# Altium project guitar-pedal.PrjPcb
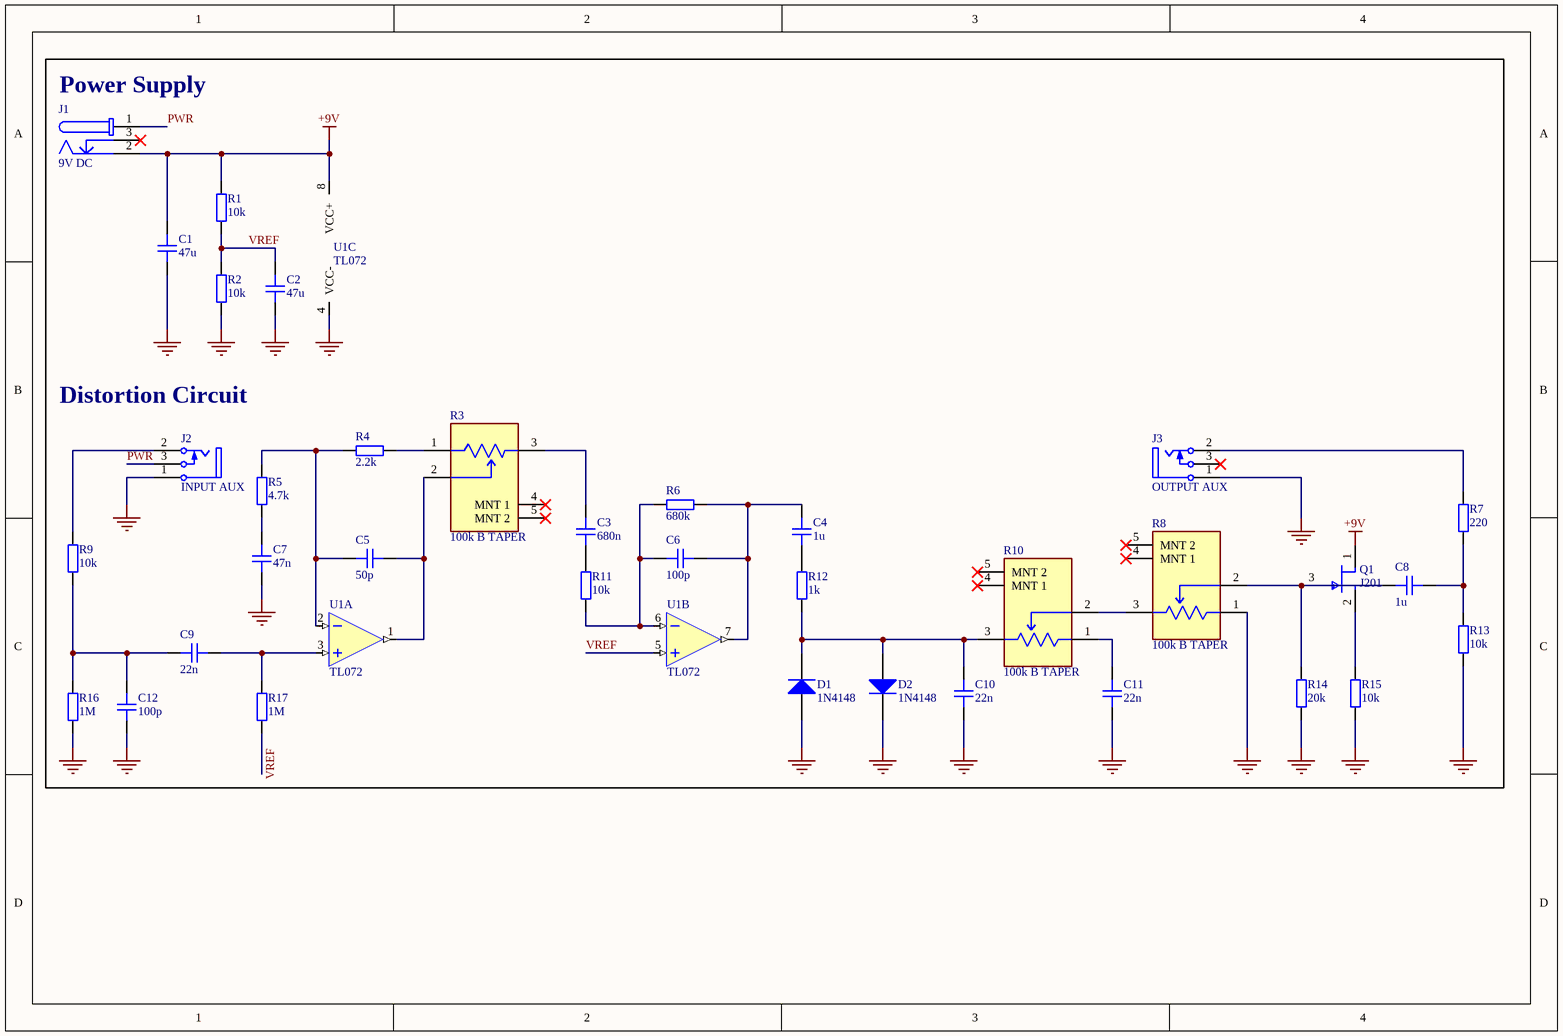
[diagram p0: schematic.SchDoc]
1 sheet, 36 parts. Net scope: global (net labels, ports and power ports of the same name join across sheets).
Board file: pcb.PcbDoc

## Sheet schematic.SchDoc
size A4; SheetNumber: 1; SheetTotal: 1

### Parts
C1  47u  [CAP_0603]
C2  47u  [CAP_0603]
C3  680n  [CAP_0603]
C4  1u  [CAP_0603]
C5  50p  [CAP_0603]
C6  100p  [CAP_0603]
C7  47n  [CAP_0603]
C8  1u  [CAP_0603]
C9  22n  [CAP_0603]
C10  22n  [CAP_0603]
C11  22n  [CAP_0603]
C12  100p  [CAP_0603]
D1  1N4148  [DIOD-SOD323-2-A_V]
D2  1N4148  [DIOD-SOD323-2-A_V]
J1  9V DC  [694106301002]
J2  INPUT AUX  [SWIT-PJRAN1X1U01X_V]
J3  OUTPUT AUX  [SWIT-PJRAN1X1U01X_V]
Q1  J201  [FP-318BM-IPC_C]
R1  10k  [RES_0603]
R2  10k  [RES_0603]
R3  100k B TAPER  [FP-PTV09A-4-MFG]
R4  2.2k  [RES_0603]
R5  4.7k  [RES_0603]
R6  680k  [RES_0603]
R7  220  [RES_0603]
R8  100k B TAPER  [FP-PTV09A-4-MFG]
R9  10k  [RES_0603]
R10  100k B TAPER  [FP-PTV09A-4-MFG]
R11  10k  [RES_0603]
R12  1k  [RES_0603]
R13  10k  [RES_0603]
R14  20k  [RES_0603]
R15  10k  [RES_0603]
R16  1M  [RES_0603]
R17  1M  [RES_0603]
U1  TL072  [SOIC-8]  (parts A,B,C of 3)

### Nets
+9V: C1.1 J1.2 Q1.1(D) R1.2 U1.8(VCC+)
GND: C1.2 C2.2 C7.2 C10.1 C11.1 C12.1 D1.1(A) D2.2(K) J2.1(SLEEVE) J3.1(SLEEVE) R2.1 R8.1 R13.1 R14.1 R15.1 R16.1 U1.4(VCC-)
PWR: J1.1 J2.3(SHUNT)
VREF: C2.1 R1.1 R2.2 R17.1 U1.5(2IN+)
NetC3_1: C3.1 R3.3
NetC3_2: C3.2 R11.2
NetC4_1: C4.1 R12.2
NetC4_2: C4.2 C6.1 R6.1 U1.7(2OUT)
NetC5_1: C5.1 R3.2 U1.1(1OUT)
NetC5_2: C5.2 R4.2 R5.2 U1.2(1IN-)
NetC6_2: C6.2 R6.2 R11.1 U1.6(2IN-)
NetC7_1: C7.1 R5.1
NetC8_1: C8.1 R7.1 R13.2
NetC8_2: C8.2 Q1.3(G) R8.2 R14.2
NetC9_1: C9.1 R17.2 U1.3(1IN+)
NetC9_2: C9.2 C12.2 R9.1 R16.2
NetC10_2: C10.2 D1.2(K) D2.1(A) R10.3 R12.1
NetC11_2: C11.2 R10.1
NetJ2_2: J2.2(TIP) R9.2
NetJ3_2: J3.2(TIP) R7.2
NetQ1_2: Q1.2(S) R15.2
NetR3_1: R3.1 R4.1
NetR8_3: R8.3 R10.2

Not connected (* = marked no-connect by the designer): J1 3*; J3 3(SHUNT)*; R3 4(MNT_1)* 5(MNT_2)*; R8 4(MNT_1)* 5(MNT_2)*; R10 4(MNT_1)* 5(MNT_2)*

### Notes on the sheet
- (near J1) Power Supply
- (near J2) Distortion Circuit

### Library data of the parts
C1-C12 = CAP_0603: Capacitor SMD 0603; Manufacturer: *; Manufacturer Part Number: *; Distributor Link: *; LCSC: *; Rating: *; Dielectric: *
D1 D2 = CMP-1667-00004-1: Fast Switching Diode, 75 V, 0.3 A, -65 to 150 degC, 2-Pin SOD323, RoHS, Tape and Reel; DatasheetVersion: Rev. 25-2, 03/2016; PackageDescription: 2-Pin Small Outline Diode, Body 1.7 x 1.3 mm; ComponentLink2Description: Datasheet; ComponentLink1URL: http://www.diodes.com/; PackageReference: SOD323-2; ComponentLink2URL: http://www.diodes.com/datasheets/ds30097.pdf; ComponentLink1Description: Manufacturer URL
J1 = CMP-1502-00188-2: NexarPartId: 52676100; Voltage Rating (DC): 20V; Gender: Male; Voltage Rating: 24V; Connector Type: Power; Insulation Resistance: 100MΩ; Current Rating: 5A; Shielding: Unshielded; Number of Contacts: 3; Color: Black; Housing Material: Polyamide; Contact Gender: Female; REACH SVHC: Unknown; Termination: Through Hole; Height: 11mm; RoHS: Compliant; Mount: Through Hole; Flammability Rating: UL94 V-0; Packaging: Bulk; Min Operating Temperature: -40°C; Contact Plating: Tin; Max Operating Temperature: 85°C; Operating Supply Voltage: 24V; Contact Material: Gold, Tin
J2 J3 = CMP-1772-00003-1: Female Phono Jack, 3 Position, Height 13 mm, Tail Length 4 mm, RoHS, Bulk; Case\Package: Radial; Type (Capacitors): X7R; Tolerance: 10%; Voltage Rating (DC): 50 V; Capacitance: 100 nF; Package Quantity: 500; Mount: Through Hole; Packaging: Bulk; Height: 3.18 mm; Min Operating Temperature: -55 degC; Radiation Hardening: No; PackageDescription: Female Phono Jack, 3 Position, Height 13 mm, Tail Length 4 mm; Length: 6.6 mm; Lead Pitch: 2.54 mm; Width: 5.08 mm; REACH SVHC: No SVHC; ComponentLink1Description: Manufacturer URL; Max Operating Temperature: 125 degC; ComponentLink2Description: Datasheet; DatasheetVersion: Rev. A, 01/2006; Voltage Rating: 50 V; ComponentLink2URL: http://www.conxall.com/Drawings/pjran1x1u__x_series_cd.pdf; ComponentLink1URL: http://www.switchcraft.com/; RoHSCompliant: true; Pins: 2; PackageReference: PJRAN1X1U01X
Q1 = CMP-07172-000003-1: JFET N-CH 40V 350MW SOT23; Manufacturer: ON Semiconductor; Manufacturer Part Number: MMBFJ201; Number Of Channels: 1; Rthja Max: 357°C/W; Gate To Source Voltage: -40V; Continuous Drain Current: 1mA; Standoff Height: 0mm; Max Junction Temp: +150°C; Temperature Range Low: -55°C; Number Of N Channels: 1; Power Dissipation: 350mW; Height: 1.2mm; Lead Free: Yes; Automotive: No; ComponentLink2Description: Datasheet; RoHS: TRUE; Temperature Range High: +150°C; Temperature: -55°C to +150°C; Device Class L3: JFETs; Device Class L1: Discrete Semiconductors; Device Class L2: Transistors; Footprint Url: https://www.onsemi.com/pub/Collateral/318BM.PDF; Ipc Land Pattern Name: SOT95P240X120-3; ComponentLink2URL: https://www.onsemi.com/pub/Collateral/MMBFJ202-D.pdf; Digikey Description: JFET N-CH 40V 350MW SOT23; Octopart: https://octopart.com/mmbfj201-on+semiconductor-84330255; Breakdown Voltage: -40V; Category: Trans; Package: 318BM; Mouser Description: JFET N-Channel Transistor General Purpose
R1 R2 R4-R7 R9 R11-R17 = RES_0603: Resistor SMD 0603; Manufacturer: *; Manufacturer Part Number: *; Distributor Link: *; LCSC: *
R3 R8 R10 = CMP-07234-000013-1: POT 10K OHM 1/20W CARBON LINEAR; Manufacturer Part Number: PTV09A-4020U-B103; Manufacturer: Bourns Inc.; Voltage Rating: 50V; Resistance: 10kΩ; Tolerance: 20%; Value: 10kΩ; Power Rating: 0.05W; Composition: Carbon; Lead Free: Yes; Device Class L1: Passive Components; Device Class L3: Variable Resistors and Potentiometers; Temperature: -10°C to +50°C; Series: PTV09; Device Class L2: Resistors; Temperature Range Low: -10°C; Height: 20.5mm; Temperature Range High: +50°C; Octopart: https://octopart.com/ptv09a-4020u-b103-bourns-1878033; Digikey Description: POT 10K OHM 1/20W CARBON LINEAR; RoHS: TRUE; ComponentLink2URL: https://www.bourns.com/docs/product-datasheets/ptv09.pdf?sfvrsn=5e1089f1_12; Package: PTV09A-4; Mouser Description: Potentiometers 10K LINEAR 20%; Category: Res; ComponentLink2Description: Datasheet; Automotive: No
U1 = TL072CDT: Dual JFET Low-Noise Operational Amplifiers; Manufacturer: STMicroelectronics; Manufacturer Part Number: TL072CDT